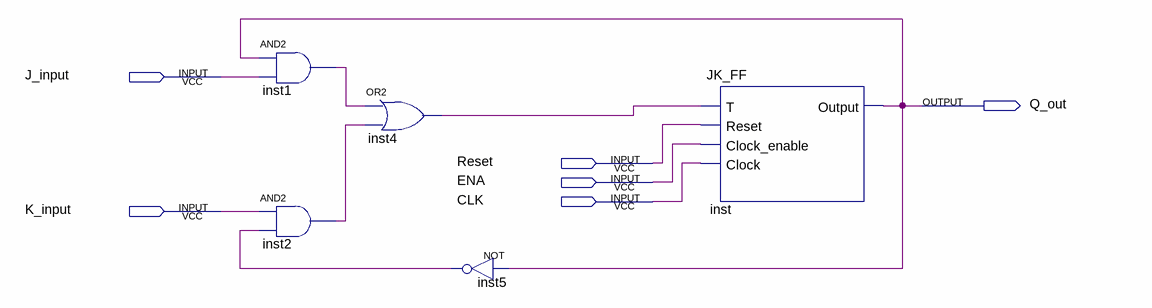
[diagram p0: schematic sheet]
// Quartus schematic Block1.bdf as structural Verilog: 5 symbols, 6 pins
module Block1 (
  input  J_input,
  input  Reset,
  input  ENA,
  input  CLK,
  input  K_input,
  output Q_out
);

  wire inst1_out, inst2_out, inst4_out, inst5_out;

  and inst1 (inst1_out, Q_out, J_input);
  and inst2 (inst2_out, K_input, inst5_out);
  or inst4 (inst4_out, inst1_out, inst2_out);
  not inst5 (inst5_out, Q_out);
  JK_FF inst (.T(inst4_out), .Reset(Reset), .Clock_enable(ENA), .Clock(CLK), .Output(Q_out));
endmodule
